# Altium project MOTHERBOARD.PrjPcb
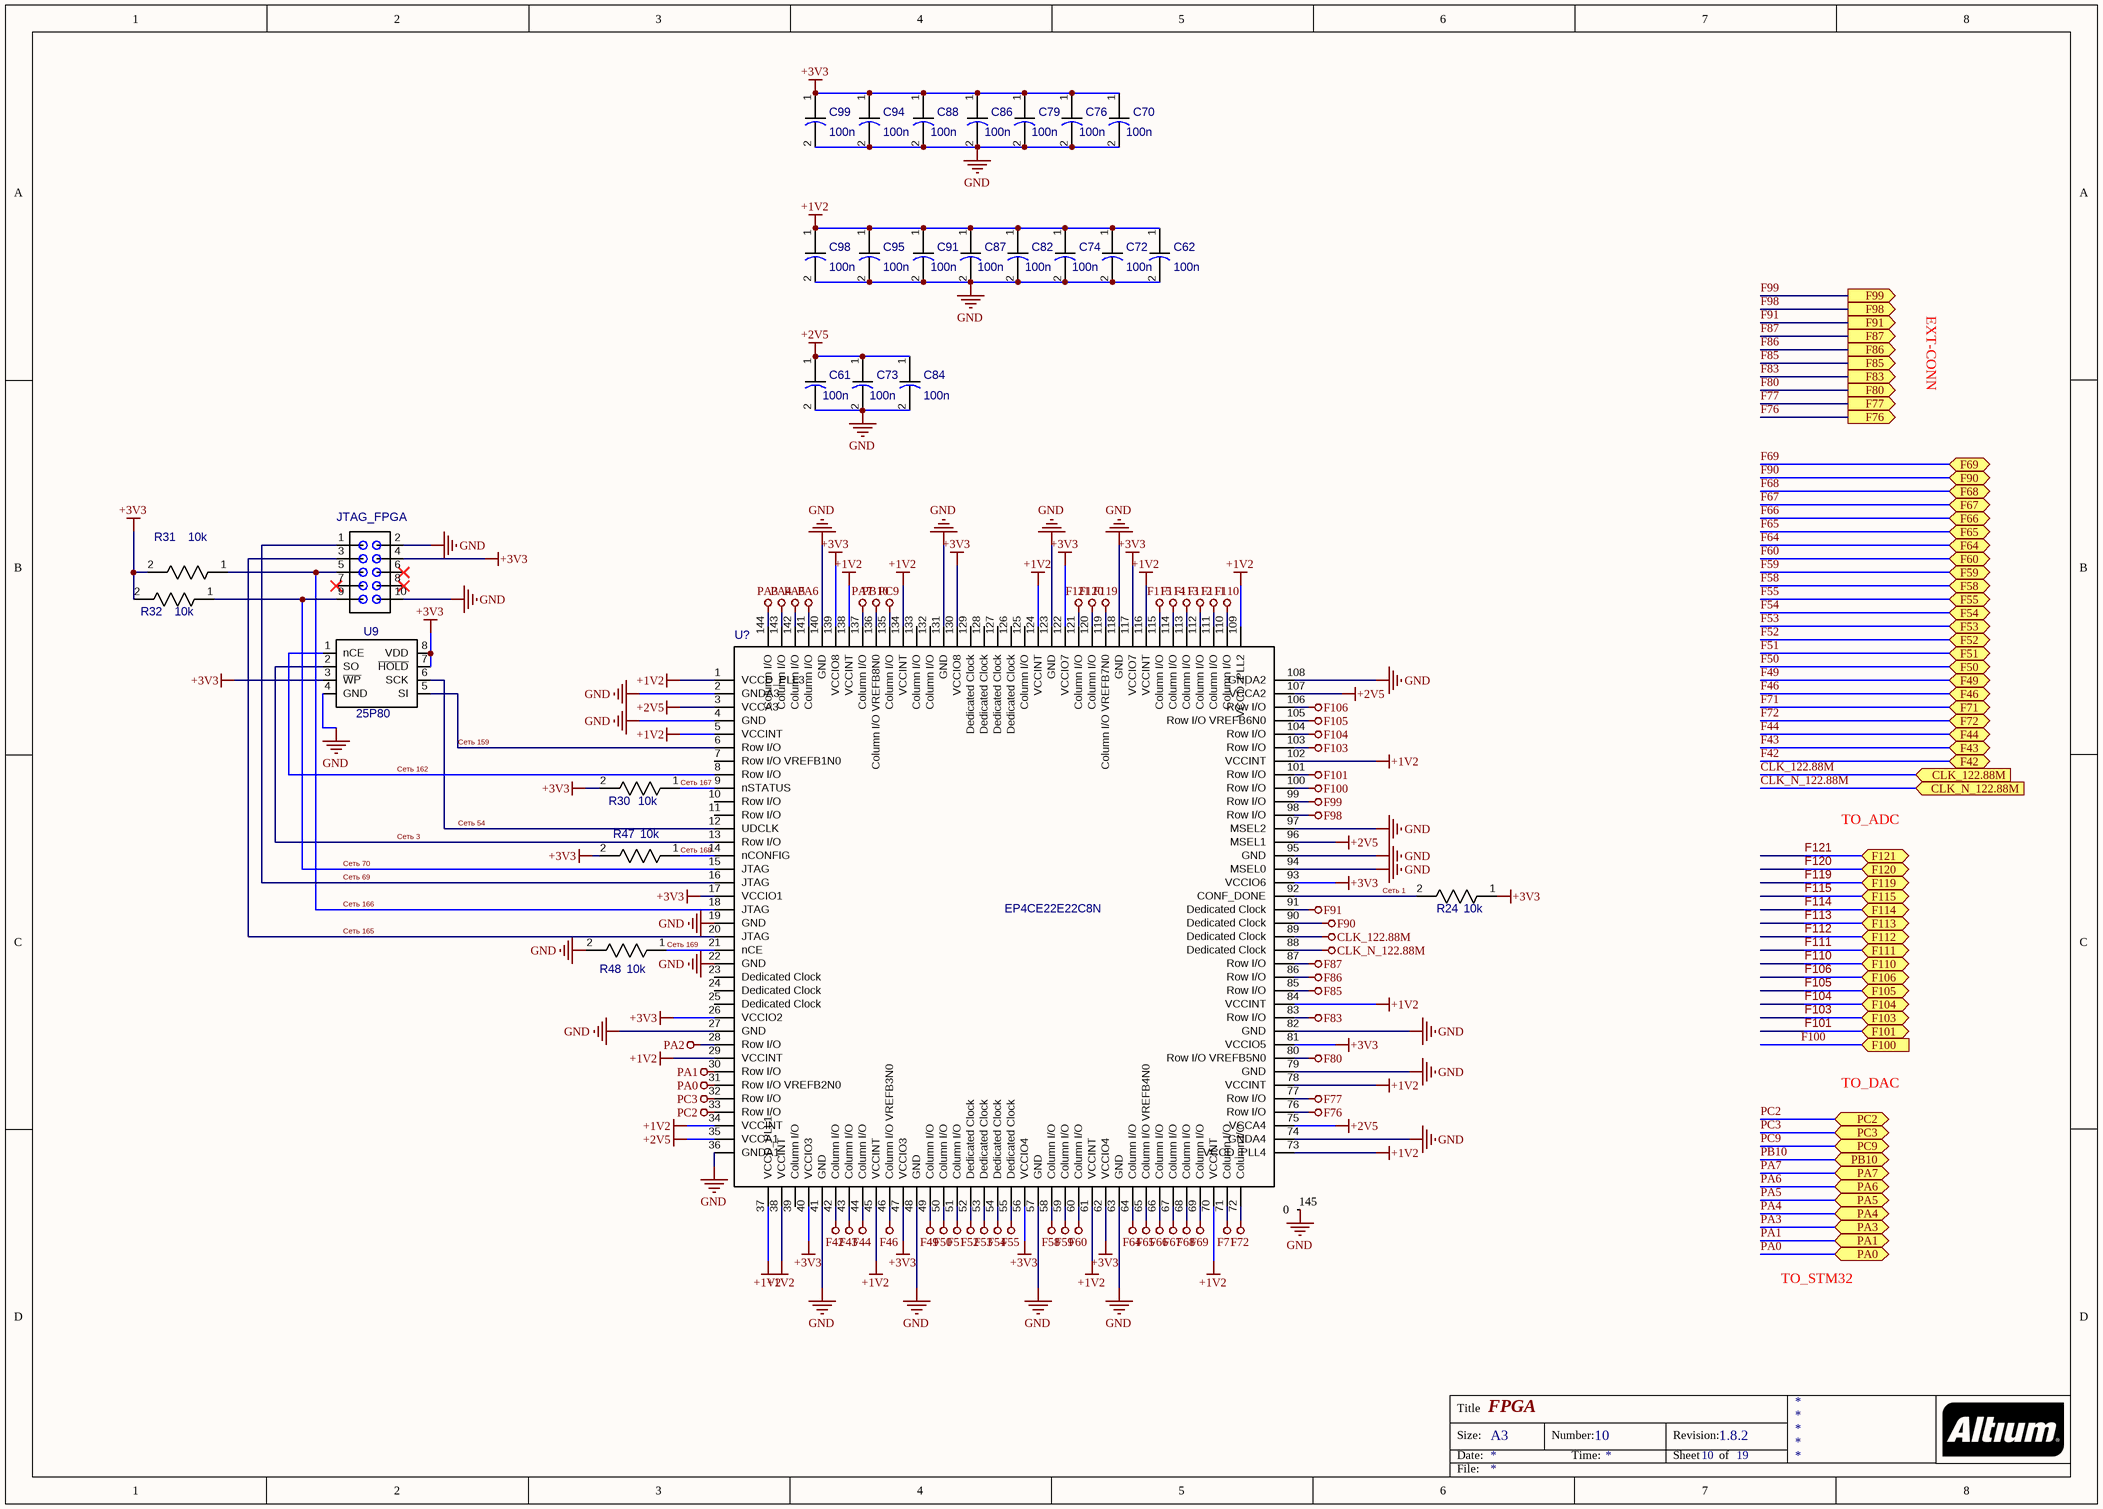
[diagram p0: FPGA.SchDoc]
2 sheets, 62 parts. Net scope: global (net labels, ports and power ports of the same name join across sheets).
Board file: MOTHERBOARD.PcbDoc
Sheets:
  FPGA.SchDoc
  STM32.SchDoc

## Sheet FPGA.SchDoc: FPGA
size A3; DocumentNumber: 10; Revision: 1.8.2; SheetNumber: 10; SheetTotal: 19

### Parts
(Parts that share a designator on the sheet are numbered #1, #2 ... from top to bottom, then left to right.)
C61  100n  [CAP_0805]
C62  100n  [CAP_0805]
C70  100n  [CAP_0805]
C72  100n  [CAP_0805]
C73  100n  [CAP_0805]
C74  100n  [CAP_0805]
C76  100n  [CAP_0805]
C79  100n  [CAP_0805]
C82  100n  [CAP_0805]
C84  100n  [CAP_0805]
C86  100n  [CAP_0805]
C87  100n  [CAP_0805]
C88  100n  [CAP_0805]
C91  100n  [CAP_0805]
C94  100n  [CAP_0805]
C95  100n  [CAP_0805]
C98  100n  [CAP_0805]
C99  100n  [CAP_0805]
JTAG_FPGA  (no value)  [IDC10]
R24  10k  [RES_0805]
R30  10k  [RES_0805]
R31  10k  [RES_0805]
R32  10k  [RES_0805]
R47  10k  [RES_0805]
R48  10k  [RES_0805]
U9  25P80  [25P80]
U?#1  EP4CE22E22C8N  [EP4CE22E22C8N]

### Ports
CLK_122.88M (in), CLK_N_122.88M (in), F42 (bidir), F43 (bidir), F44 (bidir), F46 (bidir), F49 (bidir), F50 (bidir), F51 (bidir), F52 (bidir), F53 (bidir), F54 (bidir), F55 (bidir), F58 (bidir), F59 (bidir), F60 (bidir), F64 (bidir), F65 (bidir), F66 (bidir), F67 (bidir), F68 (bidir), F69 (bidir), F71 (bidir), F72 (bidir), F76 (out), F77 (out), F80 (out), F83 (out), F85 (out), F86 (out), F87 (out), F90 (bidir), F91 (out), F98 (out), F99 (out), F100 (in), F101 (bidir), F103 (bidir), F104 (bidir), F105 (bidir), F106 (bidir), F110 (bidir), F111 (bidir), F112 (bidir), F113 (bidir), F114 (bidir), F115 (bidir), F119 (bidir), F120 (bidir), F121 (bidir), PA0 (bidir), PA1 (bidir), PA3 (bidir), PA4 (bidir), PA5 (bidir), PA6 (bidir), PA7 (bidir), PB10 (bidir), PC2 (bidir), PC3 (bidir), PC9 (bidir)

### Nets
+1V2: C62.1 C72.1 C74.1 C82.1 C87.1 C91.1 C95.1 C98.1 U?#1.1(VCCD_PLL3) U?#1.5(VCCINT) U?#1.29(VCCINT) U?#1.34(VCCINT) U?#1.37(VCCD_PLL1) U?#1.38(VCCINT) U?#1.45(VCCINT) U?#1.61(VCCINT) U?#1.70(VCCINT) U?#1.73(VCCD_PLL4) U?#1.78(VCCINT) U?#1.84(VCCINT) U?#1.102(VCCINT) U?#1.109(VCCD_PLL2) U?#1.116(VCCINT) U?#1.124(VCCINT) U?#1.134(VCCINT) U?#1.138(VCCINT)
+2V5: C61.1 C73.1 C84.1 U?#1.3(VCCA3) U?#1.35(VCCA1) U?#1.75(VCCA4) U?#1.96(MSEL1) U?#1.107(VCCA2)
+3V3: C70.1 C76.1 C79.1 C86.1 C88.1 C94.1 C99.1 JTAG_FPGA.4 R24.1 R30.2 R31.2 R32.2 R47.2 U9.3(~{WP}) U9.7(~{HOLD}) U9.8(VDD) U?#1.17(VCCIO1) U?#1.26(VCCIO2) U?#1.40(VCCIO3) U?#1.47(VCCIO3) U?#1.56(VCCIO4) U?#1.62(VCCIO4) U?#1.81(VCCIO5) U?#1.93(VCCIO6) U?#1.117(VCCIO7) U?#1.122(VCCIO7) U?#1.130(VCCIO8) U?#1.139(VCCIO8)
CLK_122.88M: U?#1.89(Dedicated_Clock) ; port CLK_122.88M
CLK_N_122.88M: U?#1.88(Dedicated_Clock) ; port CLK_N_122.88M
F42: U?#1.42(Column_I/O) ; port F42
F43: U?#1.43(Column_I/O) ; port F43
F44: U?#1.44(Column_I/O) ; port F44
F46: U?#1.46(Column_I/O_VREFB3N0) ; port F46
F49: U?#1.49(Column_I/O) ; port F49
F50: U?#1.50(Column_I/O) ; port F50
F51: U?#1.51(Column_I/O) ; port F51
F52: U?#1.52(Dedicated_Clock) ; port F52
F53: U?#1.53(Dedicated_Clock) ; port F53
F54: U?#1.54(Dedicated_Clock) ; port F54
F55: U?#1.55(Dedicated_Clock) ; port F55
F58: U?#1.58(Column_I/O) ; port F58
F59: U?#1.59(Column_I/O) ; port F59
F60: U?#1.60(Column_I/O) ; port F60
F64: U?#1.64(Column_I/O) ; port F64
F65: U?#1.65(Column_I/O_VREFB4N0) ; port F65
F66: U?#1.66(Column_I/O) ; port F66
F67: U?#1.67(Column_I/O) ; port F67
F68: U?#1.68(Column_I/O) ; port F68
F69: U?#1.69(Column_I/O) ; port F69
F71: U?#1.71(Column_I/O) ; port F71
F72: U?#1.72(Column_I/O) ; port F72
F76: U?#1.76(Row_I/O) ; port F76
F77: U?#1.77(Row_I/O) ; port F77
F80: U?#1.80(Row_I/O_VREFB5N0) ; port F80
F83: U?#1.83(Row_I/O) ; port F83
F85: U?#1.85(Row_I/O) ; port F85
F86: U?#1.86(Row_I/O) ; port F86
F87: U?#1.87(Row_I/O) ; port F87
F90: U?#1.90(Dedicated_Clock) ; port F90
F91: U?#1.91(Dedicated_Clock) ; port F91
F98: U?#1.98(Row_I/O) ; port F98
F99: U?#1.99(Row_I/O) ; port F99
F100: U?#1.100(Row_I/O) ; port F100
F101: U?#1.101(Row_I/O) ; port F101
F103: U?#1.103(Row_I/O)
F104: U?#1.104(Row_I/O) ; port F104
F105: U?#1.105(Row_I/O_VREFB6N0) ; port F105
F106: U?#1.106(Row_I/O) ; port F106
F110: U?#1.110(Column_I/O) ; port F110
F111: U?#1.111(Column_I/O) ; port F111
F112: U?#1.112(Column_I/O)
F113: U?#1.113(Column_I/O) ; port F113
F114: U?#1.114(Column_I/O) ; port F114
F115: U?#1.115(Column_I/O) ; port F115
F119: U?#1.119(Column_I/O_VREFB7N0) ; port F119
F120: U?#1.120(Column_I/O) ; port F120
F121: U?#1.121(Column_I/O) ; port F121
GND: C61.2 C62.2 C70.2 C72.2 C73.2 C74.2 C76.2 C79.2 C82.2 C84.2 C86.2 C87.2 C88.2 C91.2 C94.2 C95.2 C98.2 C99.2 JTAG_FPGA.2 JTAG_FPGA.10 R48.2 U9.4(GND) U?#1.2(GNDA3) U?#1.4(GND) U?#1.19(GND) U?#1.22(GND) U?#1.27(GND) U?#1.36(GNDA1) U?#1.41(GND) U?#1.48(GND) U?#1.57(GND) U?#1.63(GND) U?#1.74(GNDA4) U?#1.79(GND) U?#1.82(GND) U?#1.94(MSEL0) U?#1.95(GND) U?#1.97(MSEL2) U?#1.108(GNDA2) U?#1.118(GND) U?#1.123(GND) U?#1.131(GND) U?#1.140(GND) U?#1.145(0)
PA0: U?#1.31(Row_I/O_VREFB2N0) ; port PA0
PA1: U?#1.30(Row_I/O) ; port PA1
PA2: U?#1.28(Row_I/O)
PA3: U?#1.144(Column_I/O) ; port PA3
PA4: U?#1.143(Column_I/O) ; port PA4
PA5: U?#1.142(Column_I/O) ; port PA5
PA6: U?#1.141(Column_I/O) ; port PA6
PA7: U?#1.137(Column_I/O) ; port PA7
PB10: U?#1.136(Column_I/O_VREFB8N0) ; port PB10
PC2: U?#1.33(Row_I/O) ; port PC2
PC3: U?#1.32(Row_I/O) ; port PC3
PC9: U?#1.135(Column_I/O) ; port PC9
Сеть 1: R24.2 U?#1.92(CONF_DONE)
Сеть 3: U9.2(SO) U?#1.13(Row_I/O)
Сеть 54: U9.6(SCK) U?#1.12(UDCLK)
Сеть 69: JTAG_FPGA.1 U?#1.16(JTAG)
Сеть 70: JTAG_FPGA.9 R32.1 U?#1.15(JTAG)
Сеть 159: U9.5(SI) U?#1.6(Row_I/O)
Сеть 162: U9.1(nCE) U?#1.8(Row_I/O)
Сеть 165: JTAG_FPGA.3 U?#1.20(JTAG)
Сеть 166: JTAG_FPGA.5 R31.1 U?#1.18(JTAG)
Сеть 167: R30.1 U?#1.9(nSTATUS)
Сеть 168: R47.1 U?#1.14(nCONFIG)
Сеть 169: R48.1 U?#1.21(nCE)

Not connected (* = marked no-connect by the designer): JTAG_FPGA 6* 7* 8*; U?#1 7(Row_I/O_VREFB1N0) 10(Row_I/O) 11(Row_I/O) 23(Dedicated_Clock) 24(Dedicated_Clock) 25(Dedicated_Clock) 39(Column_I/O) 125(Column_I/O) 126(Dedicated_Clock) 127(Dedicated_Clock) 128(Dedicated_Clock) 129(Dedicated_Clock) 132(Column_I/O) 133(Column_I/O)

### Notes on the sheet
- EXT-CONN
- TO_ADC
- TO_DAC
- TO_STM32
- Title
- Size:
- Date:
- A3
- Number:
- Time:
- Revision:
- Sheet
- of
- File:

### Library data of the parts
C61 C62 C70 C72-C74 C76 C79 C82 C84 C86-C88 C91 C94 C95 C98 C99 = CAP_0805: Value: 100n
JTAG_FPGA = IDC10
R24 R30-R32 R47 R48 = RES_0805: Value: 10k
U9 = 25P80: Value: 25P80
U?#1 = EP4CE22E22C8N: Value: EP4CE22E22C8N

## Sheet STM32.SchDoc: STM32
size A3; DocumentNumber: 12; Revision: 1.8.2; SheetNumber: 12; SheetTotal: 19
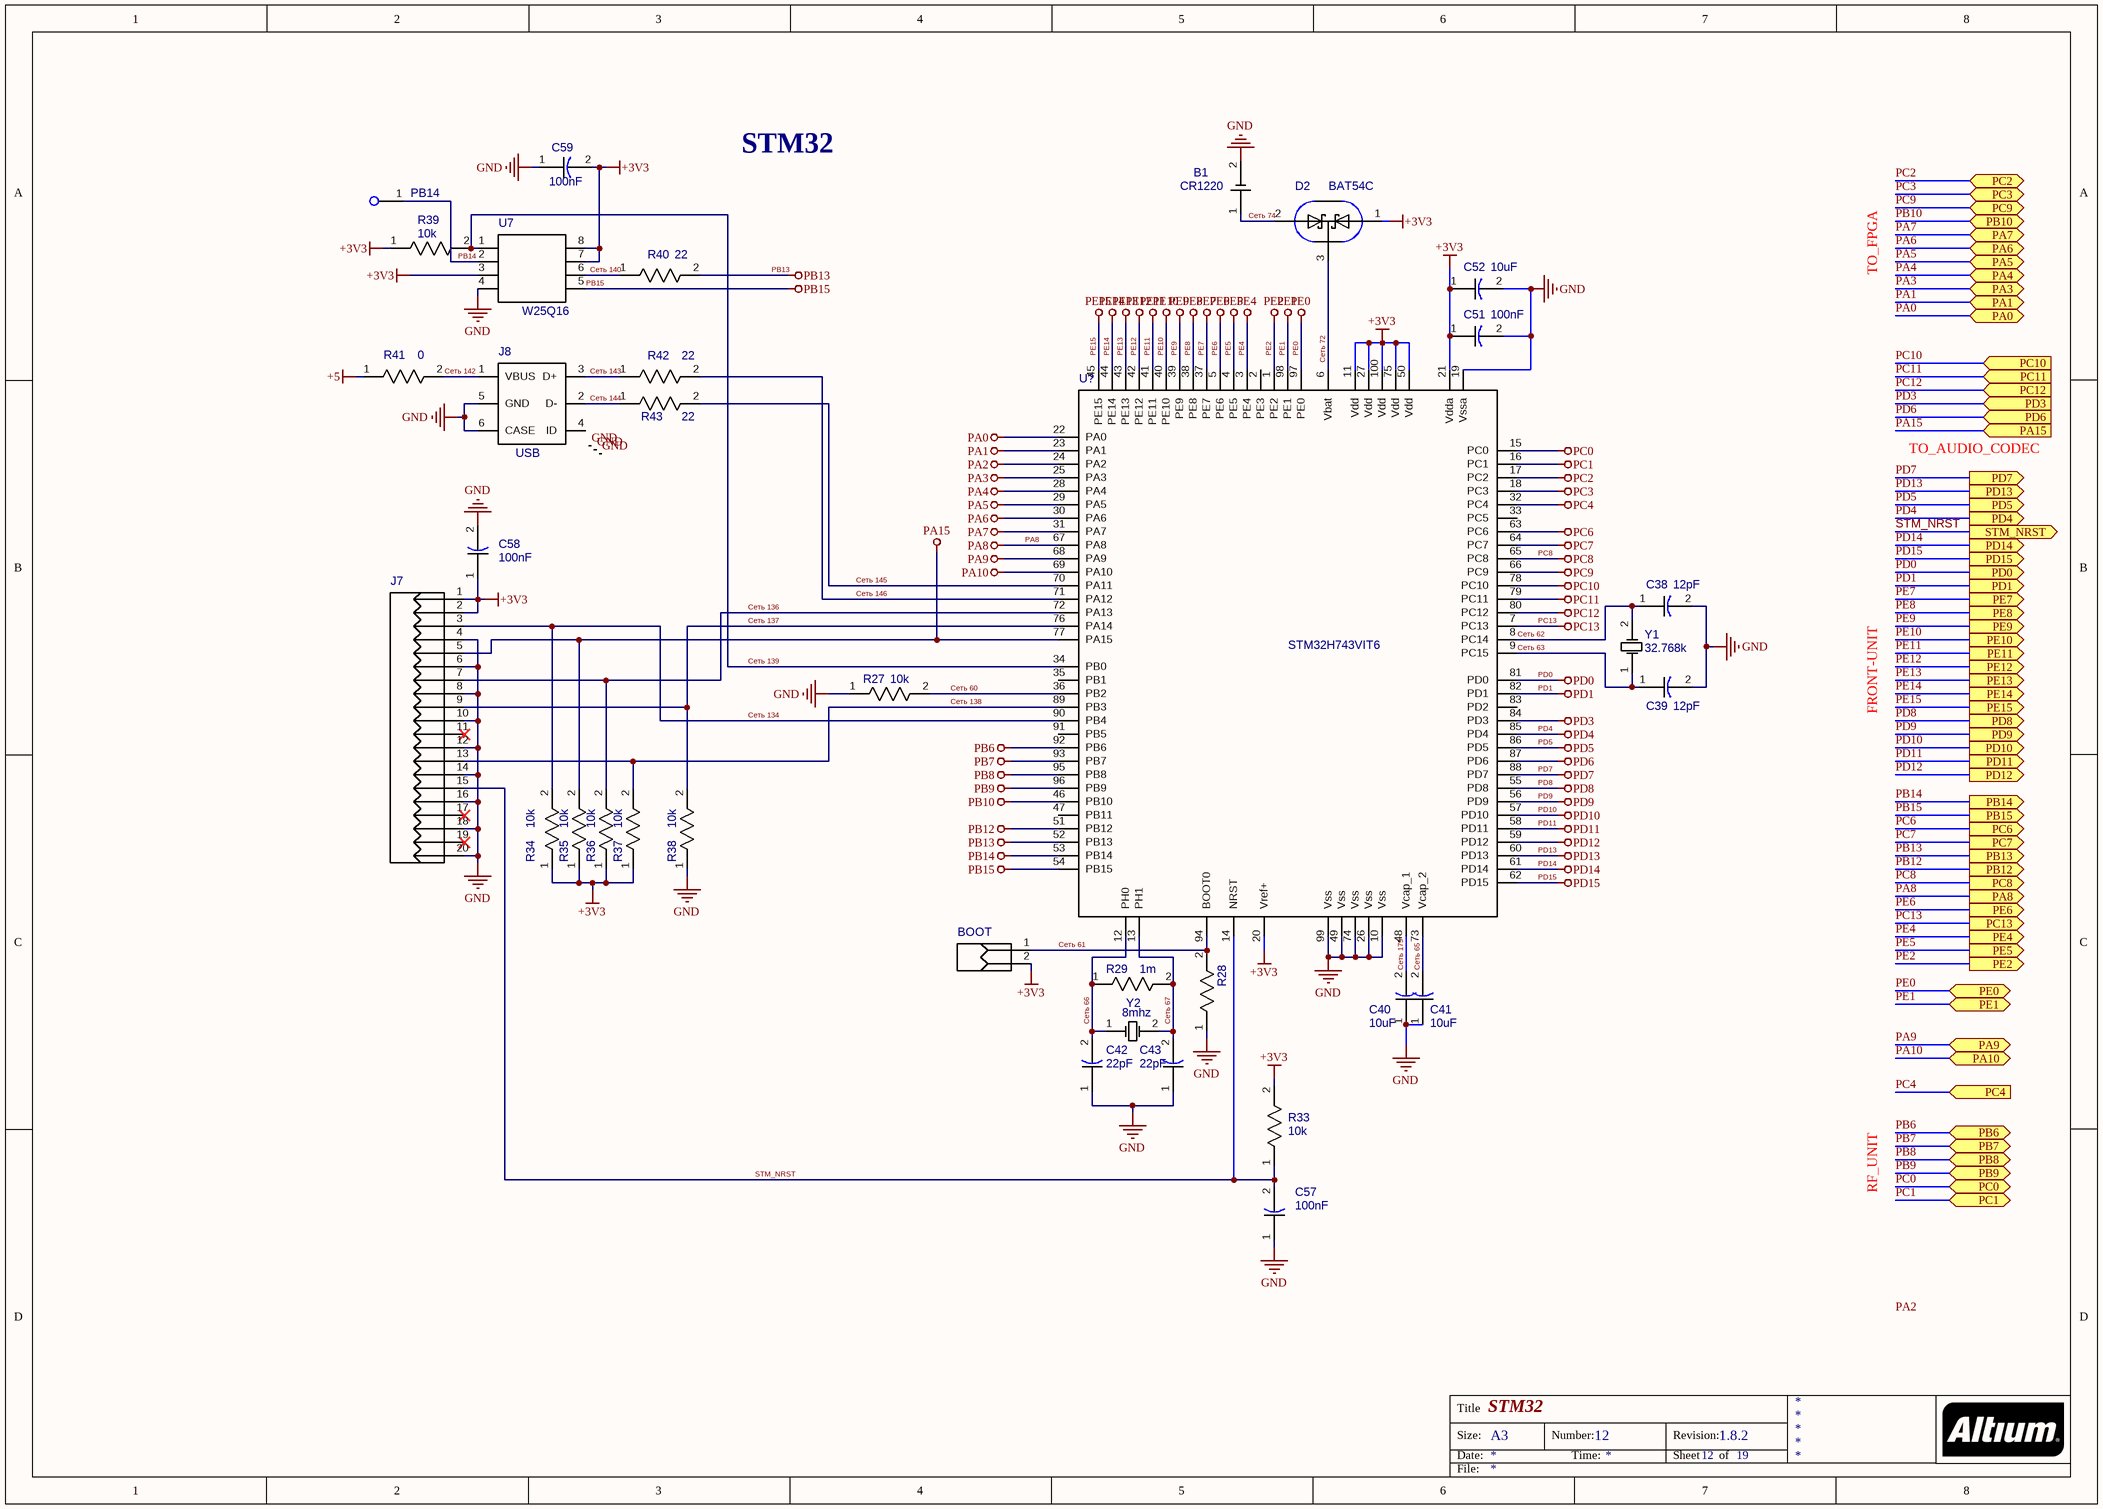
[diagram p1: STM32.SchDoc]

### Parts
(Parts that share a designator on the sheet are numbered #1, #2 ... from top to bottom, then left to right.)
B1  CR1220  [BR1632A/FA]
BOOT  (no value)  [51022-0200]
C38  12pF  [CAP_0805]
C39  12pF  [CAP_0805]
C40  10uF  [CAP_0805]
C41  10uF  [CAP_0805]
C42  22pF  [CAP_0805]
C43  22pF  [CAP_0805]
C51  100nF  [CAP_0805]
C52  10uF  [CAP_0805]
C57  100nF  [CAP_0805]
C58  100nF  [CAP_0805]
C59  100nF  [CAP_0805]
D2  BAT54C  [BAT54C]
J7  JTAG_STM32  [90131-0130]  (value not drawn)
J8  USB  [2-1734035-3]
NetPort?  PB14  (graphical)
R27  10k  [RES_0805]
R28  10k  [RES_0805]  (value not drawn)
R29  1m  [RES_0805]
R33  10k  [RES_0805]
R34  10k  [RES_0805]
R35  10k  [RES_0805]
R36  10k  [RES_0805]
R37  10k  [RES_0805]
R38  10k  [RES_0805]
R39  10k  [RES_0805]
R40  22  [RES_0805]
R41  0  [RES_0805]
R42  22  [RES_0805]
R43  22  [RES_0805]
U7  W25Q16  [W25Q16]
U?#2  STM32H743VIT6  [STM32H743VIT6]
Y1  32.768k  [R26-32.768]
Y2  8mhz  [ECS-200-20-1]

### Ports
PA0 (bidir), PA1 (bidir), PA3 (bidir), PA4 (bidir), PA5 (bidir), PA6 (bidir), PA7 (bidir), PA8 (out), PA9 (bidir), PA10 (bidir), PA15 (in), PB6 (bidir), PB7 (bidir), PB8 (bidir), PB9 (bidir), PB10 (bidir), PB12 (out), PB13 (out), PB14 (out), PB15 (out), PC0 (bidir), PC1 (bidir), PC2 (bidir), PC3 (bidir), PC4 (in), PC6 (out), PC7 (out), PC8 (out), PC9 (bidir), PC10 (in), PC11 (in), PC12 (in), PC13 (out), PD0 (out), PD1 (out), PD3 (in), PD4 (out), PD5 (out), PD6 (in), PD7 (out), PD8 (out), PD9 (out), PD10 (out), PD11 (out), PD12 (out), PD13 (out), PD14 (out), PD15 (out), PE0 (bidir), PE1 (bidir), PE2 (out), PE4 (out), PE5 (out), PE6 (out), PE7 (out), PE8 (out), PE9 (out), PE10 (out), PE11 (out), PE12 (out), PE13 (out), PE14 (out), PE15 (out), STM_NRST (out)

### Nets
+3V3: BOOT.2 C51.1 C52.1 C58.1 C59.2 D2.1((A1)) J7.1(P1) J7.2(P2) R33.2 R34.1 R35.1 R36.1 R37.1 R39.1 U7.3(WP) U7.7(HOLD) U7.8(VCC) U?#2.11(Vdd) U?#2.20(Vref+) U?#2.21(Vdda) U?#2.27(Vdd) U?#2.50(Vdd) U?#2.75(Vdd) U?#2.100(Vdd)
+5: R41.1
GND: B1.2(NEG) C38.2 C39.2 C40.1 C41.1 C42.1 C43.1 C51.2 C52.2 C57.1 C58.2 C59.1 J7.4(P4) J7.6(P6) J7.8(P8) J7.10(P10) J7.12(P12) J7.14(P14) J7.16(P16) J7.18(P18) J7.20(P20) J8.5(GND) J8.6(CASE) J8.7 J8.8 J8.9 R27.1 R28.1 R38.1 U7.4(GND) U?#2.10(Vss) U?#2.19(Vssa) U?#2.26(Vss) U?#2.49(Vss) U?#2.74(Vss) U?#2.99(Vss)
PA0: U?#2.22(PA0) ; port PA0
PA1: U?#2.23(PA1) ; port PA1
PA2: U?#2.24(PA2)
PA3: U?#2.25(PA3) ; port PA3
PA4: U?#2.28(PA4) ; port PA4
PA5: U?#2.29(PA5) ; port PA5
PA6: U?#2.30(PA6) ; port PA6
PA7: U?#2.31(PA7) ; port PA7
PA8: U?#2.67(PA8) ; port PA8
PA9: U?#2.68(PA9) ; port PA9
PA10: U?#2.69(PA10) ; port PA10
PA15: J7.5(P5) R35.2 U?#2.77(PA15) ; port PA15
PB6: U?#2.92(PB6) ; port PB6
PB7: U?#2.93(PB7) ; port PB7
PB8: U?#2.95(PB8) ; port PB8
PB9: U?#2.96(PB9) ; port PB9
PB10: U?#2.46(PB10) ; port PB10
PB12: U?#2.51(PB12) ; port PB12
PB13: R40.2 U?#2.52(PB13) ; port PB13
PB14: NetPort?.1 U7.2(SO) U?#2.53(PB14) ; port PB14
PB15: U7.5(SI) U?#2.54(PB15) ; port PB15
PC0: U?#2.15(PC0) ; port PC0
PC1: U?#2.16(PC1) ; port PC1
PC2: U?#2.17(PC2) ; port PC2
PC3: U?#2.18(PC3) ; port PC3
PC4: U?#2.32(PC4) ; port PC4
PC6: U?#2.63(PC6) ; port PC6
PC7: U?#2.64(PC7) ; port PC7
PC8: U?#2.65(PC8) ; port PC8
PC9: U?#2.66(PC9) ; port PC9
PC10: U?#2.78(PC10) ; port PC10
PC11: U?#2.79(PC11) ; port PC11
PC12: U?#2.80(PC12) ; port PC12
PC13: U?#2.7(PC13) ; port PC13
PD0: U?#2.81(PD0) ; port PD0
PD1: U?#2.82(PD1) ; port PD1
PD3: U?#2.84(PD3) ; port PD3
PD4: U?#2.85(PD4) ; port PD4
PD5: U?#2.86(PD5) ; port PD5
PD6: U?#2.87(PD6) ; port PD6
PD7: U?#2.88(PD7) ; port PD7
PD8: U?#2.55(PD8) ; port PD8
PD9: U?#2.56(PD9) ; port PD9
PD10: U?#2.57(PD10) ; port PD10
PD11: U?#2.58(PD11) ; port PD11
PD12: U?#2.59(PD12) ; port PD12
PD13: U?#2.60(PD13) ; port PD13
PD14: U?#2.61(PD14) ; port PD14
PD15: U?#2.62(PD15) ; port PD15
PE0: U?#2.97(PE0) ; port PE0
PE1: U?#2.98(PE1) ; port PE1
PE2: U?#2.1(PE2) ; port PE2
PE4: U?#2.3(PE4) ; port PE4
PE5: U?#2.4(PE5) ; port PE5
PE6: U?#2.5(PE6) ; port PE6
PE7: U?#2.37(PE7) ; port PE7
PE8: U?#2.38(PE8) ; port PE8
PE9: U?#2.39(PE9) ; port PE9
PE10: U?#2.40(PE10) ; port PE10
PE11: U?#2.41(PE11) ; port PE11
PE12: U?#2.42(PE12) ; port PE12
PE13: U?#2.43(PE13) ; port PE13
PE14: U?#2.44(PE14) ; port PE14
PE15: U?#2.45(PE15) ; port PE15
STM_NRST: C57.2 J7.15(P15) R33.1 U?#2.14(NRST) ; port STM_NRST
Сеть 60: R27.2 U?#2.36(PB2)
Сеть 61: BOOT.1 R28.2 U?#2.94(BOOT0)
Сеть 62: C38.1 U?#2.8(PC14) Y1.2(OSC2)
Сеть 63: C39.1 U?#2.9(PC15) Y1.1(OSC1)
Сеть 65: C41.2 U?#2.73(Vcap_2)
Сеть 66: C42.2 R29.1 U?#2.12(PH0) Y2.1(OSC1)
Сеть 67: C43.2 R29.2 U?#2.13(PH1) Y2.2(OSC2)
Сеть 72: D2.3((K1),(K2)) U?#2.6(Vbat)
Сеть 74: B1.1(POS) D2.2((A2))
Сеть 134: J7.3(P3) R34.2 U?#2.90(PB4)
Сеть 136: J7.7(P7) R36.2 U?#2.72(PA13)
Сеть 137: J7.9(P9) R38.2 U?#2.76(PA14)
Сеть 138: J7.13(P13) R37.2 U?#2.89(PB3)
Сеть 139: R39.2 U7.1(CS) U?#2.34(PB0)
Сеть 140: R40.1 U7.6(CLK)
Сеть 142: J8.1(VBUS) R41.2
Сеть 143: J8.3(D+) R42.1
Сеть 144: J8.2(D-) R43.1
Сеть 145: R43.2 U?#2.70(PA11)
Сеть 146: R42.2 U?#2.71(PA12)
Сеть 179: C40.2 U?#2.48(Vcap_1)

Not connected (* = marked no-connect by the designer): J7 11(P11)* 17(P17)* 19(P19)*; J8 4(ID); U?#2 2(PE3) 33(PC5) 35(PB1) 47(PB11) 83(PD2) 91(PB5)

### Notes on the sheet
- STM32
- TO_FPGA
- TO_AUDIO_CODEC
- FRONT-UNIT
- RF_UNIT
- Labels drawn without touching a wire or pin: PA2
- Title
- Size:
- Date:
- A3
- Number:
- Time:
- Revision:
- Sheet
- of
- File:

### Library data of the parts
B1 = BR1632A/FA: Value: CR1220
BOOT = 51022-0200
C38-C43 C51 C52 C57-C59 = CAP_0805
  C38 C39: Value: 12pF
  C40 C41 C52: Value: 10uF
  C42 C43: Value: 22pF
  C51 C57-C59: Value: 100nF
J7 = 90131-0130: Value: JTAG_STM32
J8 = 2-1734035-3: Value: USB
R27-R29 R33-R43 = RES_0805
  R27 R28 R33-R39: Value: 10k
  R29: Value: 1m
  R40 R42 R43: Value: 22
  R41: Value: 0
Y1 = R26-32.768: Value: 32.768k
Y2 = ECS-200-20-1: Value: 8mhz
D2 = BAT54C: Value: BAT54C
U7 = W25Q16: Value: W25Q16
U?#2 = STM32H743VIT6: Value: STM32H743VIT6

## Nets that join several sheets
+3V3: FPGA (28 pins), STM32 (24 pins)
GND: FPGA (44 pins), STM32 (36 pins)
PA0: FPGA (U?#1.31), STM32 (U?#2.22)
PA1: FPGA (U?#1.30), STM32 (U?#2.23)
PA2: FPGA (U?#1.28), STM32 (U?#2.24)
PA3: FPGA (U?#1.144), STM32 (U?#2.25)
PA4: FPGA (U?#1.143), STM32 (U?#2.28)
PA5: FPGA (U?#1.142), STM32 (U?#2.29)
PA6: FPGA (U?#1.141), STM32 (U?#2.30)
PA7: FPGA (U?#1.137), STM32 (U?#2.31)
PB10: FPGA (U?#1.136), STM32 (U?#2.46)
PC2: FPGA (U?#1.33), STM32 (U?#2.17)
PC3: FPGA (U?#1.32), STM32 (U?#2.18)
PC9: FPGA (U?#1.135), STM32 (U?#2.66)